# EAGLE schematic darwin-weather-module (EAGLE 9.6.1)
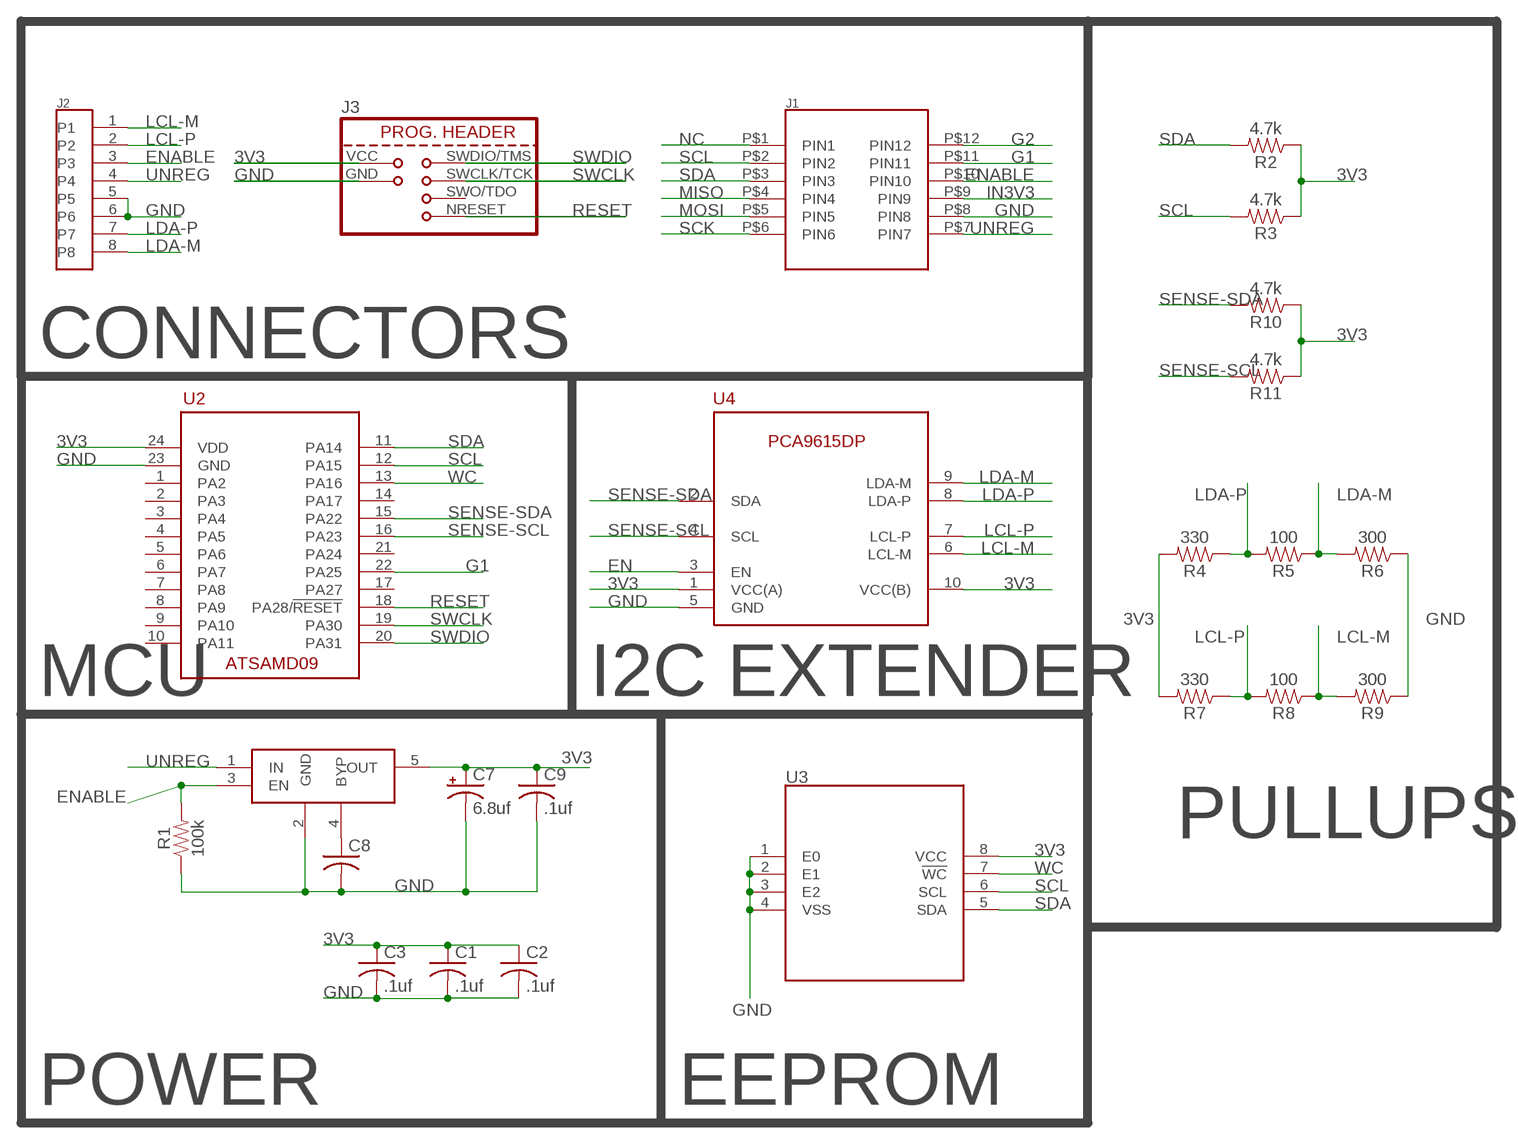
[diagram p0: schematic, sheet 1]

## Parts
C1  .1uf  C-USC0603K  [C0603K]
C2  .1uf  C-USC0603K  [C0603K]
C3  .1uf  C-USC0603K  [C0603K]
C7  6.8uf  CPOL-USA/3216-18R  [A/3216-18R]
C8  C-USC0603K  [C0603K]
C9  .1uf  C-USC0603K  [C0603K]
J1  2X6-HEADERS  [M20-7810645]
J2  95501-6889VERT  [85513-5009]
J3  TAG-CONNECT  [TC2030-IDC]
R1  100k  100KOHM-0603-1/10W-1%  [0603]
R2  4.7k  100KOHM-0603-1/10W-1%  [0603]
R3  4.7k  100KOHM-0603-1/10W-1%  [0603]
R4  330  100KOHM-0603-1/10W-1%  [0603]
R5  100  100KOHM-0603-1/10W-1%  [0603]
R6  300  100KOHM-0603-1/10W-1%  [0603]
R7  330  100KOHM-0603-1/10W-1%  [0603]
R8  100  100KOHM-0603-1/10W-1%  [0603]
R9  300  100KOHM-0603-1/10W-1%  [0603]
R10  4.7k  100KOHM-0603-1/10W-1%  [0603]
R11  4.7k  100KOHM-0603-1/10W-1%  [0603]
U2  ATSAMD09  [QFN50P400X400X100-25T200]
U3  M24C02-WMN6TP  [SOIC127P600X175-8]
U4  PCA9615  [SOP50P490X110-10]
U$4  MIC5219-3.3YM5-TR  [SOT95P280X145-5]

## Nets
3V3: C1.1 C2.1 C3.1 C7.+ C9.1 J3.VCC R2.1 R3.1 R4.2 R7.2 R10.1 R11.1 U2.24(VDD) U3.8(VCC) U4.1(VCC(A)) U4.10(VCC(B)) U$4.5(OUT)
EN: U4.3(EN)
ENABLE: J1.P$10(PIN10) J2.3 R1.2 U$4.3(EN)
G1: J1.P$11(PIN11) U2.22(PA25)
G2: J1.P$12(PIN12)
GND: C1.2 C2.2 C3.2 C7.- C8.2 C9.2 J1.P$8(PIN8) J2.5 J2.6 J3.GND R1.1 R6.1 R9.1 U2.23(GND) U3.1(E0) U3.2(E1) U3.3(E2) U3.4(VSS) U4.5(GND) U$4.2(GND)
IN3V3: J1.P$9(PIN9)
LCL-M: J2.1 R8.1 R9.2 U4.6(LCL-M)
LCL-P: J2.2 R7.1 R8.2 U4.7(LCL-P)
LDA-M: J2.8 R5.1 R6.2 U4.9(LDA-M)
LDA-P: J2.7 R4.1 R5.2 U4.8(LDA-P)
MISO: J1.P$4(PIN4)
MOSI: J1.P$5(PIN5)
N$6: C8.1 U$4.4(BYP)
NC: J1.P$1(PIN1)
RESET: J3.NRESET(RESET) U2.18(PA28/!RESET)
SCK: J1.P$6(PIN6)
SCL: J1.P$2(PIN2) R3.2 U2.12(PA15) U3.6(SCL)
SDA: J1.P$3(PIN3) R2.2 U2.11(PA14) U3.5(SDA)
SENSE-SCL: R11.2 U2.16(PA23) U4.4(SCL)
SENSE-SDA: R10.2 U2.15(PA22) U4.2(SDA)
SWCLK: J3.SWCLK/TCK(SWCLK) U2.19(PA30)
SWDIO: J3.SWDIO/TMS(SWDIO) U2.20(PA31)
UNREG: J1.P$7(PIN7) J2.4 U$4.1(IN)
WC: U2.13(PA16) U3.7(!WC)
Unconnected: J3.SWO/TDO(SWO) U2.1(PA2) U2.2(PA3) U2.3(PA4) U2.4(PA5) U2.5(PA6) U2.6(PA7) U2.7(PA8) U2.8(PA9) U2.9(PA10) U2.10(PA11) U2.14(PA17) U2.17(PA27) U2.21(PA24)

## Notes on the sheet
- CONNECTORS
- MCU | I2C EXTENDER
- PULLUPS
- POWER | EEPROM

## Library data of the parts
C1-C3 C8 C9 = rcl:C-US: CAPACITOR, American symbol; SPICEPREFIX: C
C7 = rcl:CPOL-US: POLARIZED CAPACITOR, American symbol; SPICEPREFIX: C
J1 = Conservify:2X6-HEADERS
J2 = Conservify:95501-6889: Molex RJ-45 Connector
J3 = Conservify:TAG-CONNECT
R1 = SparkFun-Resistors:100KOHM: 100kΩ resistor A resistor is a passive two-terminal electrical component that implements electrical resistance as a circuit element. Resistors act to reduce current flow, and, at the same time, act to lower voltage levels within circuits. - Wikipedia; PROD_ID: RES-07828
R2-R11 = SparkFun-Resistors:100KOHM: 100kΩ resistor A resistor is a passive two-terminal electrical component that implements electrical resistance as a circuit element. Resistors act to reduce current flow, and, at the same time, act to lower voltage levels within circuits. - Wikipedia; PROD_ID: RES-07828; VALUE: 100k
U2 = Conservify:ATSAMD09
U3 = Conservify:M24C02-WMN6TP
U4 = Conservify:PCA9615
U$4 = Conservify:MIC5219-3.3YM5-TR